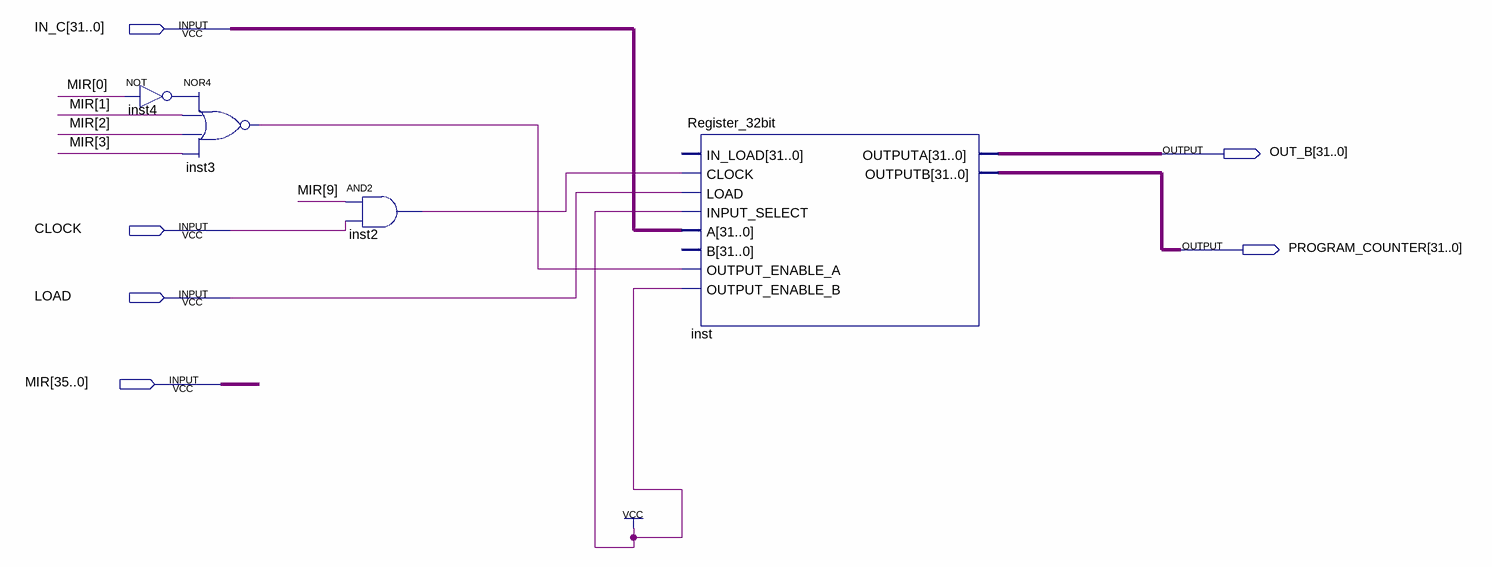
[diagram p0: schematic sheet]
// Quartus schematic PC.bdf as structural Verilog: 4 symbols, 6 pins
module PC (
  input  [31:0] IN_C,
  input  CLOCK,
  input  LOAD,
  input  [35:0] MIR,
  output [31:0] OUT_B,
  output [31:0] PROGRAM_COUNTER
);

  wire inst2_out, inst3_out, inst4_out;

  nor inst3 (inst3_out, inst4_out, MIR[1], MIR[2], MIR[3]);
  not inst4 (inst4_out, MIR[0]);
  and inst2 (inst2_out, MIR[9], CLOCK);
  Register_32bit inst (
    .CLOCK(inst2_out), .LOAD(LOAD), .INPUT_SELECT(1'b1), .A(IN_C), .OUTPUT_ENABLE_A(inst3_out),
    .OUTPUT_ENABLE_B(1'b1), .OUTPUTA(OUT_B), .OUTPUTB(PROGRAM_COUNTER));  // open: IN_LOAD, B
endmodule
